# Altium schematic sheet 3_Communication_Buffers.SchDoc
size A4; Organization: SpaceLab UFSC; Address1: UFSC - SpaceLab; Address2: University Campus - Trindade; Address3: Dep. of Electrical Engineering - CTC; Address4: Florianópolis, Santa Catarina, Brazil; DocumentNumber: 4; SheetNumber: 4; SheetTotal: 4; Address5: CEP: 88040 - 900
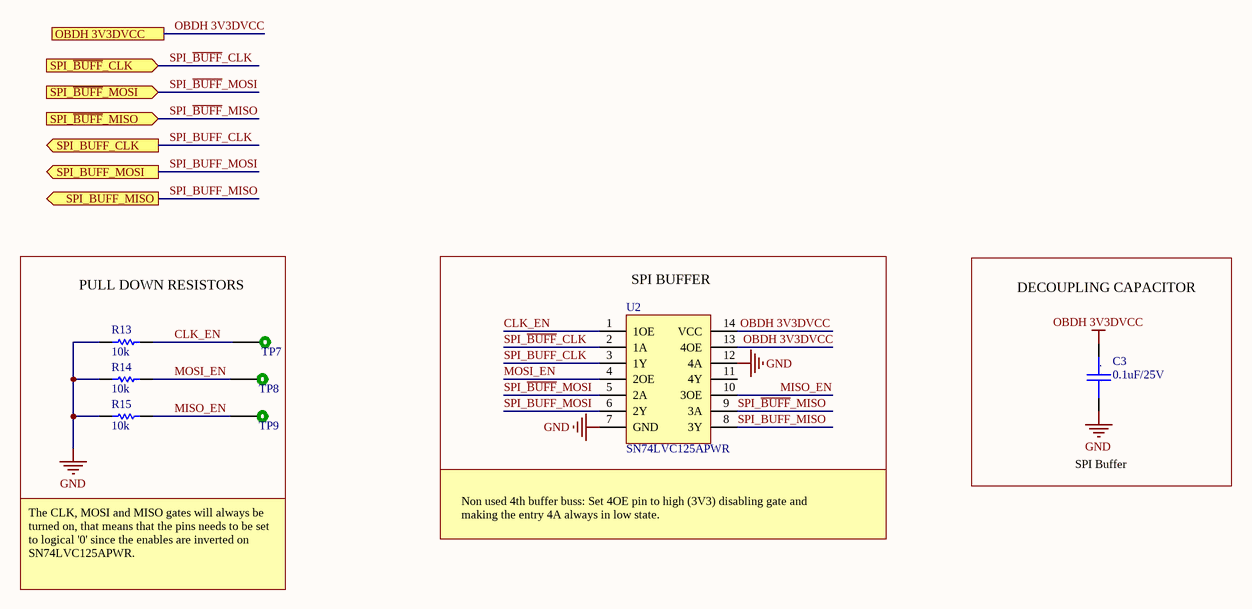
[diagram p0: 3_Communication_Buffers.SchDoc]

## Parts
C3  0.1uF/25V  [C0805_MD]
R13  10k  [0805]
R14  10k  [0805]
R15  10k  [0805]
TP7  TEST_POINT_2  [TEST_POINT_2]  (value not drawn)  (no BOM)
TP8  TEST_POINT_2  [TEST_POINT_2]  (value not drawn)  (no BOM)
TP9  TEST_POINT_2  [TEST_POINT_2]  (value not drawn)  (no BOM)
U2  SN74LVC125APWR  [SN74LVC125APWR]

## Blocks framed on the sheet
PULL DOWN RESISTORS: R13-R15 TP7-TP9
SPI BUFFER: U2
DECOUPLING CAPACITOR: C3

## Ports
OBDH 3V3DVCC, SPI_BUFF_CLK (out), SPI_BUFF_MISO (out), SPI_BUFF_MOSI (out), SPI_~{BUFF}_CLK (in), SPI_~{BUFF}_MISO (in), SPI_~{BUFF}_MOSI (in)

## Nets
GND: C3.2 R13.2 R14.2 R15.2 U2.7(GND) U2.12(4A)
OBDH 3V3DVCC: C3.1 U2.13(4OE) U2.14(VCC) ; port OBDH 3V3DVCC
CLK_EN: R13.1 TP7.1 U2.1(1OE)
MISO_EN: R15.1 TP9.1 U2.10(3OE)
MOSI_EN: R14.1 TP8.1 U2.4(2OE)
SPI_~{BUFF}_CLK: U2.2(1A) ; port SPI_~{BUFF}_CLK
SPI_~{BUFF}_MISO: U2.9(3A) ; port SPI_~{BUFF}_MISO
SPI_~{BUFF}_MOSI: U2.5(2A) ; port SPI_~{BUFF}_MOSI
SPI_BUFF_CLK: U2.3(1Y) ; port SPI_BUFF_CLK
SPI_BUFF_MISO: U2.8(3Y) ; port SPI_BUFF_MISO
SPI_BUFF_MOSI: U2.6(2Y) ; port SPI_BUFF_MOSI

Not connected (* = marked no-connect by the designer): U2 11(4Y)

## Notes on the sheet
- SPI Buffer
- The CLK, MOSI and MISO gates will always be turned on, that means that the pins needs to be set to logical '0' since the enables are inverted on SN74LVC125APWR.
- Non used 4th buffer buss: Set 4OE pin to high (3V3) disabling gate and making the entry 4A always in low state.
- Date:
- Title:
- Size:
- A4
- Project:
- Time:
- Sheet
- of
- Revision:
- UFSC - SpaceLab
- University Campus - Trindade
- Dep. of Electrical Engineering - CTC
- Florianópolis, Santa Catarina, Brazil
- CEP: 88040 - 900
- Drawn By:
- Model:
- (in symbol Cap_Cer_X7R_0.1uF_25V_0805) .

## Library data of the parts
C3 = Cap_Cer_X7R_0.1uF_25V_0805: CAP CER 0.1UF 25V 10% X7R 0805; Partnumber: CC0805KRX7R8BB104; Manufacturer: Yageo; Capacitance: 100nF; Insulation Resistance: 100GR; Material: Ceramic; NCM: 8532.24.10; Case/Package: 0805; Case Code (Imperial): 0805; Case Code (Metric): 2012; ComponentLink1Description: http://www.yageo.com/documents/recent/UPY-GPHC_X7R_6.3V-to-50V_18.pdf?src-supplier=Digi-Key; ComponentLink1URL: http://www.yageo.com/documents/recent/UPY-GPHC_X7R_6.3V-to-50V_18.pdf?src-supplier=Digi-Key; ComponentLink2Description: http://www.farnell.com/datasheets/1489800.pdf?src-supplier=Element14; ComponentLink2URL: http://www.farnell.com/datasheets/1489800.pdf?src-supplier=Element14; ComponentLink3Description: http://www.yageo.com/documents/recent/UPY-GPHC_X7R_6.3V-to-50V_18.pdf?src-supplier=Digi-Key; ComponentLink3URL: http://www.yageo.com/documents/recent/UPY-GPHC_X7R_6.3V-to-50V_18.pdf?src-supplier=Digi-Key; ComponentLink4Description: http://www.farnell.com/datasheets/1489800.pdf?src-supplier=Element14; ComponentLink4URL: http://www.farnell.com/datasheets/1489800.pdf?src-supplier=Element14; ComponentLink5Description: http://www.farnell.com/datasheets/1850775.pdf?src-supplier=Element14; ComponentLink5URL: http://www.farnell.com/datasheets/1850775.pdf?src-supplier=Element14; ComponentLink6Description: https://www.verical.com/server-webapp/html/getDatasheet?partID=330244&src-supplier=Verical; ComponentLink6URL: https://www.verical.com/server-webapp/html/getDatasheet?partID=330244&src-supplier=Verical; ComponentLink7Description: http://www.yageo.com/documents/recent/UPY-GPHC_X7R_6.3V-to-50V_8.pdf?src-supplier=Avnet+Europe; ComponentLink7URL: http://www.yageo.com/documents/recent/UPY-GPHC_X7R_6.3V-to-50V_8.pdf?src-supplier=Avnet+Europe; ComponentLink8Description: http://www.farnell.com/datasheets/1784427.pdf?src-supplier=Element14; ComponentLink8URL: http://www.farnell.com/datasheets/1784427.pdf?src-supplier=Element14; ComponentLink9Description: http://www.farnell.com/datasheets/70765.pdf?src-supplier=Element14; ComponentLink9URL: http://www.farnell.com/datasheets/70765.pdf?src-supplier=Element14; Composition: Ceramic; Depth: 1.25mm; Dielectric: X7R; Halogen Free: Halogen Free; Height: 0.85mm; Lead Free: Lead Free; Length: 2mm; Manufacturer Part Number: CC0805KRX7R8BB104; Max Operating Temperature: 125°C; Min Operating Temperature: -55°C; Mount: Surface Mount; Number of Pins: 2; Package Quantity: 1; Packaging: Tape and Reel; Pricing 1: 1=0.14, 10=0.097, 100=0.0458, 500=0.0321, 1000=0.02658 (USD); Pricing 2: 1=0.11, 10=0.08, 100=0.03, 1000=0.025, 4000=0.019, 8000=0.018, 24000=0.015, 48000=0.014, 100000=0.013 (USD); Radiation Hardening: No; REACH SVHC: No SVHC; Stock 1: 243958; Stock 2: 131050; Supplier 1: Digi-Key; Supplier 2: Mouser; Supplier Part Number 1: 311-1141-1-ND; Supplier Part Number 2: 603-CC805KRX7R8BB104; Termination: SMD/SMT; Thickness: 0.033inch; Tolerance: 10%; Voltage Rating (DC): 25V; Voltage Rating: 25V; Width: 0.049inch
R13-R15 = R10k_1%_1/8W_0805: RES 10K OHM 1/8W 1%  0805; Partnumber: CRCW080510K0FKEA; Manufacturer: Vishay; Power Rating: 125mW; Resistance: 10kR; Temperature Coefficient: 100ppm/°C; Voltage Rating (DC): 150V; NCM: 8533.21.20; Case/Package: 0805; Case Code (Imperial): 0805; Case Code (Metric): 2012; ComponentLink1Description: https://www.digikey.com/product-detail/en/vishay-dale/CRCW080510K0FKEA/541-10-0KCCT-ND/1180897; ComponentLink1URL: https://www.digikey.com/product-detail/en/vishay-dale/CRCW080510K0FKEA/541-10-0KCCT-ND/1180897; ComponentLink2Description: https://br.mouser.com/ProductDetail/Vishay-Dale/CRCW080510K0FKEA?qs=sGAEpiMZZMu61qfTUdNhG2DpbjADlD3GOIdKSeOTyFU%3D; ComponentLink2URL: https://br.mouser.com/ProductDetail/Vishay-Dale/CRCW080510K0FKEA?qs=sGAEpiMZZMu61qfTUdNhG2DpbjADlD3GOIdKSeOTyFU%3D; ComponentLink3Description: http://www.mouser.com/ds/2/427/dcrcwe3-109170.pdf?src-supplier=Mouser; ComponentLink3URL: http://www.mouser.com/ds/2/427/dcrcwe3-109170.pdf?src-supplier=Mouser; ComponentLink4Description: http://uk.rs-online.com/webdocs/0d98/0900766b80d98b26.pdf?src-supplier=RSComponents; ComponentLink4URL: http://uk.rs-online.com/webdocs/0d98/0900766b80d98b26.pdf?src-supplier=RSComponents; ComponentLink5Description: http://www.alliedelec.com/m/d/0c934d6939ccefa68dbe0b96d821c8cf.pdf?src-supplier=Allied+Electronics; ComponentLink5URL: http://www.alliedelec.com/m/d/0c934d6939ccefa68dbe0b96d821c8cf.pdf?src-supplier=Allied+Electronics; ComponentLink6Description: http://www.vishay.com/docs/20035/dcrcwe3.pdf?src-supplier=Avnet+Asia; ComponentLink6URL: http://www.vishay.com/docs/20035/dcrcwe3.pdf?src-supplier=Avnet+Asia; ComponentLink7Description: http://www.vishay.com/docs/20035/dcrcwe3.pdf?src-supplier=Avnet+Europe; ComponentLink7URL: http://www.vishay.com/docs/20035/dcrcwe3.pdf?src-supplier=Avnet+Europe; ComponentLink8Description: http://www.farnell.com/datasheets/2310790.pdf?src-supplier=Element14; ComponentLink8URL: http://www.farnell.com/datasheets/2310790.pdf?src-supplier=Element14; ComponentLink9Description: http://www.vishay.com/docs/20035/dcrcwe3.pdf?src-supplier=Avnet; ComponentLink9URL: http://www.vishay.com/docs/20035/dcrcwe3.pdf?src-supplier=Avnet; ComponentLink10Description: http://www.vishay.com/docs/20035/dcrcwe3.pdf?src-supplier=Future+Electronics; ComponentLink10URL: http://www.vishay.com/docs/20035/dcrcwe3.pdf?src-supplier=Future+Electronics; Composition: Thick Film; Contact Plating: Tin; Depth: 1.25mm; Height: 0.45mm; Lead Free: Lead Free; Length: 2mm; Manufacturer Part Number: CRCW080510K0FKEA; Max Operating Temperature: 155°C; Military Standard: Not; Min Operating Temperature: -55°C; Package Quantity: 5000; Packaging: Tape and Reel; Pricing 1: 1=0.1, 10=0.062, 100=0.0254, 1000=0.01142, 2500=0.00991 (USD); Pricing 2: 1=0.1, 10=0.062, 100=0.025, 1000=0.01, 5000=0.007, 10000=0.006 (USD); Radiation Hardening: No; REACH SVHC: Unknown; Stock 1: 1478098; Stock 2: 157494; Supplier 1: Digi-Key; Supplier 2: Mouser; Supplier Part Number 1: 541-10.0KCCT-ND; Supplier Part Number 2: 71-CRCW0805-10K-E3; Termination: SMD/SMT; Tolerance: 1%; Voltage Rating: 150V; Weight: 0.000194oz; Width: 1.25mm
TP7-TP9 = TEST_POINT_2: Test point
U2 = SN74LVC125APWR: IC BUF NON-INVERT 3.6V 14TSSOP; Manufacturer: Texas Instruments; Number of Inputs: 4; Min Supply Voltage: 1.65V; Logic Function: Buffer,Inverting; Max Power Dissipation: 500mW; Propagation Delay: 4.6ns; Number of Bits per Element: 1; High Level Output Current: -24mA; Low Level Output Current: 24mA; Number of Output Lines: 3; Polarity: Non-Inverting; Turn-On Delay Time: 5.3ns; Quiescent Current: 1uA; Supplier 1: Digi-Key; Manufacturer Part Number: SN74LVC125APWR; Stock 1: 51249; Pricing 1: 1=0.35, 10=0.282, 25=0.258, 100=0.192, 250=0.174, 500=0.144, 1000=0.108 (USD); Mount: Surface Mount; Case/Package: TSSOP; Number of Pins: 14; Contact Plating: Gold; Min Operating Temperature: -40°C; Max Operating Temperature: 125°C; Package Quantity: 1; Number of Elements: 4; Packaging: Tape and Reel; Max Supply Voltage: 3.6V; Number of Channels: 4; Number of Outputs: 4; Number of Input Lines: 4; Number of Bits: 4; Termination: SMD/SMT; Number of Circuits: 4; Number of Gates: 4; Length: 5mm; Height: 1.15mm; Width: 4.4mm; Radiation Hardening: No; REACH SVHC: No SVHC; Lead Free: Lead Free; ComponentLink1URL: https://www.digikey.com/product-detail/en/texas-instruments/SN74LVC125APWR/296-1222-1-ND/276490; ComponentLink1Description: https://www.digikey.com/product-detail/en/texas-instruments/SN74LVC125APWR/296-1222-1-ND/276490; ComponentLink2URL: https://br.mouser.com/ProductDetail/Texas-Instruments/SN74LVC125APWR?qs=sGAEpiMZZMuiiWkaIwCK2SeqB8b8eM7HVlo3jiw3ikc%3D; ComponentLink2Description: https://br.mouser.com/ProductDetail/Texas-Instruments/SN74LVC125APWR?qs=sGAEpiMZZMuiiWkaIwCK2SeqB8b8eM7HVlo3jiw3ikc%3D; ComponentLink3URL: http://www.ti.com/lit/ds/symlink/sn74lvc125a.pdf?src-supplier=Digi-Key; ComponentLink3Description: http://www.ti.com/lit/ds/symlink/sn74lvc125a.pdf?src-supplier=Digi-Key; ComponentLink4URL: http://www.ti.com/general/docs/lit/getliterature.tsp?genericPartNumber=SN74LVC125A&&fileType=pdf&src-supplier=Avnet; ComponentLink4Description: http://www.ti.com/general/docs/lit/getliterature.tsp?genericPartNumber=SN74LVC125A&&fileType=pdf&src-supplier=Avnet; Supplier Part Number 1: 296-1222-1-ND; ComponentLink5Description: http://www.farnell.com/datasheets/1764352.pdf?src-supplier=Element14; ComponentLink5URL: http://www.farnell.com/datasheets/1764352.pdf?src-supplier=Element14; ComponentLink6Description: http://www.produktinfo.conrad.com/datenblaetter/1000000-1099999/001017107-da-01-en-IC_BUS_BUF_Q_SN74LVC125APWR_TSSOP_14_TID.pdf?src-supplier=Conrad; ComponentLink6URL: http://www.produktinfo.conrad.com/datenblaetter/1000000-1099999/001017107-da-01-en-IC_BUS_BUF_Q_SN74LVC125APWR_TSSOP_14_TID.pdf?src-supplier=Conrad; Pricing 2: 1=0.34, 10=0.265, 100=0.143, 1000=0.107, 2000=0.092, 10000=0.086 (USD); Stock 2: 22689; Supplier 2: Mouser; Supplier Part Number 2: 595-SN74LVC125APWR